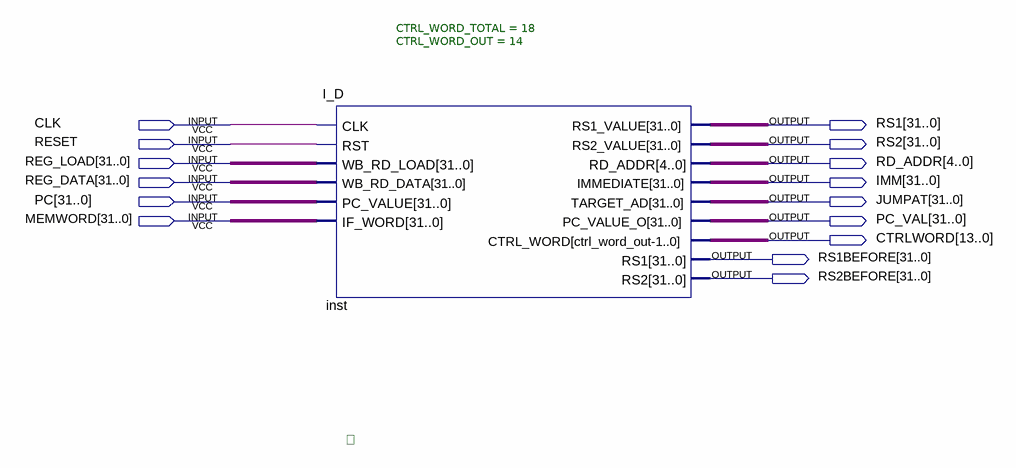
[diagram p0: schematic sheet]
// Quartus schematic I_DTEST.bdf as structural Verilog: 1 symbols, 15 pins
module I_DTEST (
  input  CLK,
  input  RESET,
  input  [31:0] REG_LOAD,
  input  [31:0] REG_DATA,
  input  [31:0] PC,
  input  [31:0] MEMWORD,
  output [31:0] RS1,
  output [31:0] RS2,
  output [4:0] RD_ADDR,
  output [31:0] IMM,
  output [31:0] JUMPAT,
  output [31:0] PC_VAL,
  output [13:0] CTRLWORD,
  output [31:0] RS1BEFORE,
  output [31:0] RS2BEFORE
);

  I_D #(.CTRL_WORD_TOTAL(18), .CTRL_WORD_OUT(14)) inst (
    .CLK(CLK), .RST(RESET), .WB_RD_LOAD(REG_LOAD), .WB_RD_DATA(REG_DATA), .PC_VALUE(PC), .IF_WORD(MEMWORD),
    .RS1_VALUE(RS1), .RS2_VALUE(RS2), .RD_ADDR(RD_ADDR), .IMMEDIATE(IMM), .TARGET_AD(JUMPAT),
    .PC_VALUE_O(PC_VAL), .CTRL_WORD(CTRLWORD), .RS1(RS1BEFORE), .RS2(RS2BEFORE));

  // Notes on the sheet:
  //   
endmodule
